# Altium schematic sheet pca20035_sheet3_nrf52_mcu.SchDoc: Thingy:91 nRF52840 MCU
size A3; Organization: Nordic Semiconductor; DocumentNumber: 3; SheetNumber: 3; SheetTotal: 6; CompanyName: Nordic Semiconductor; DocumentSize: A3
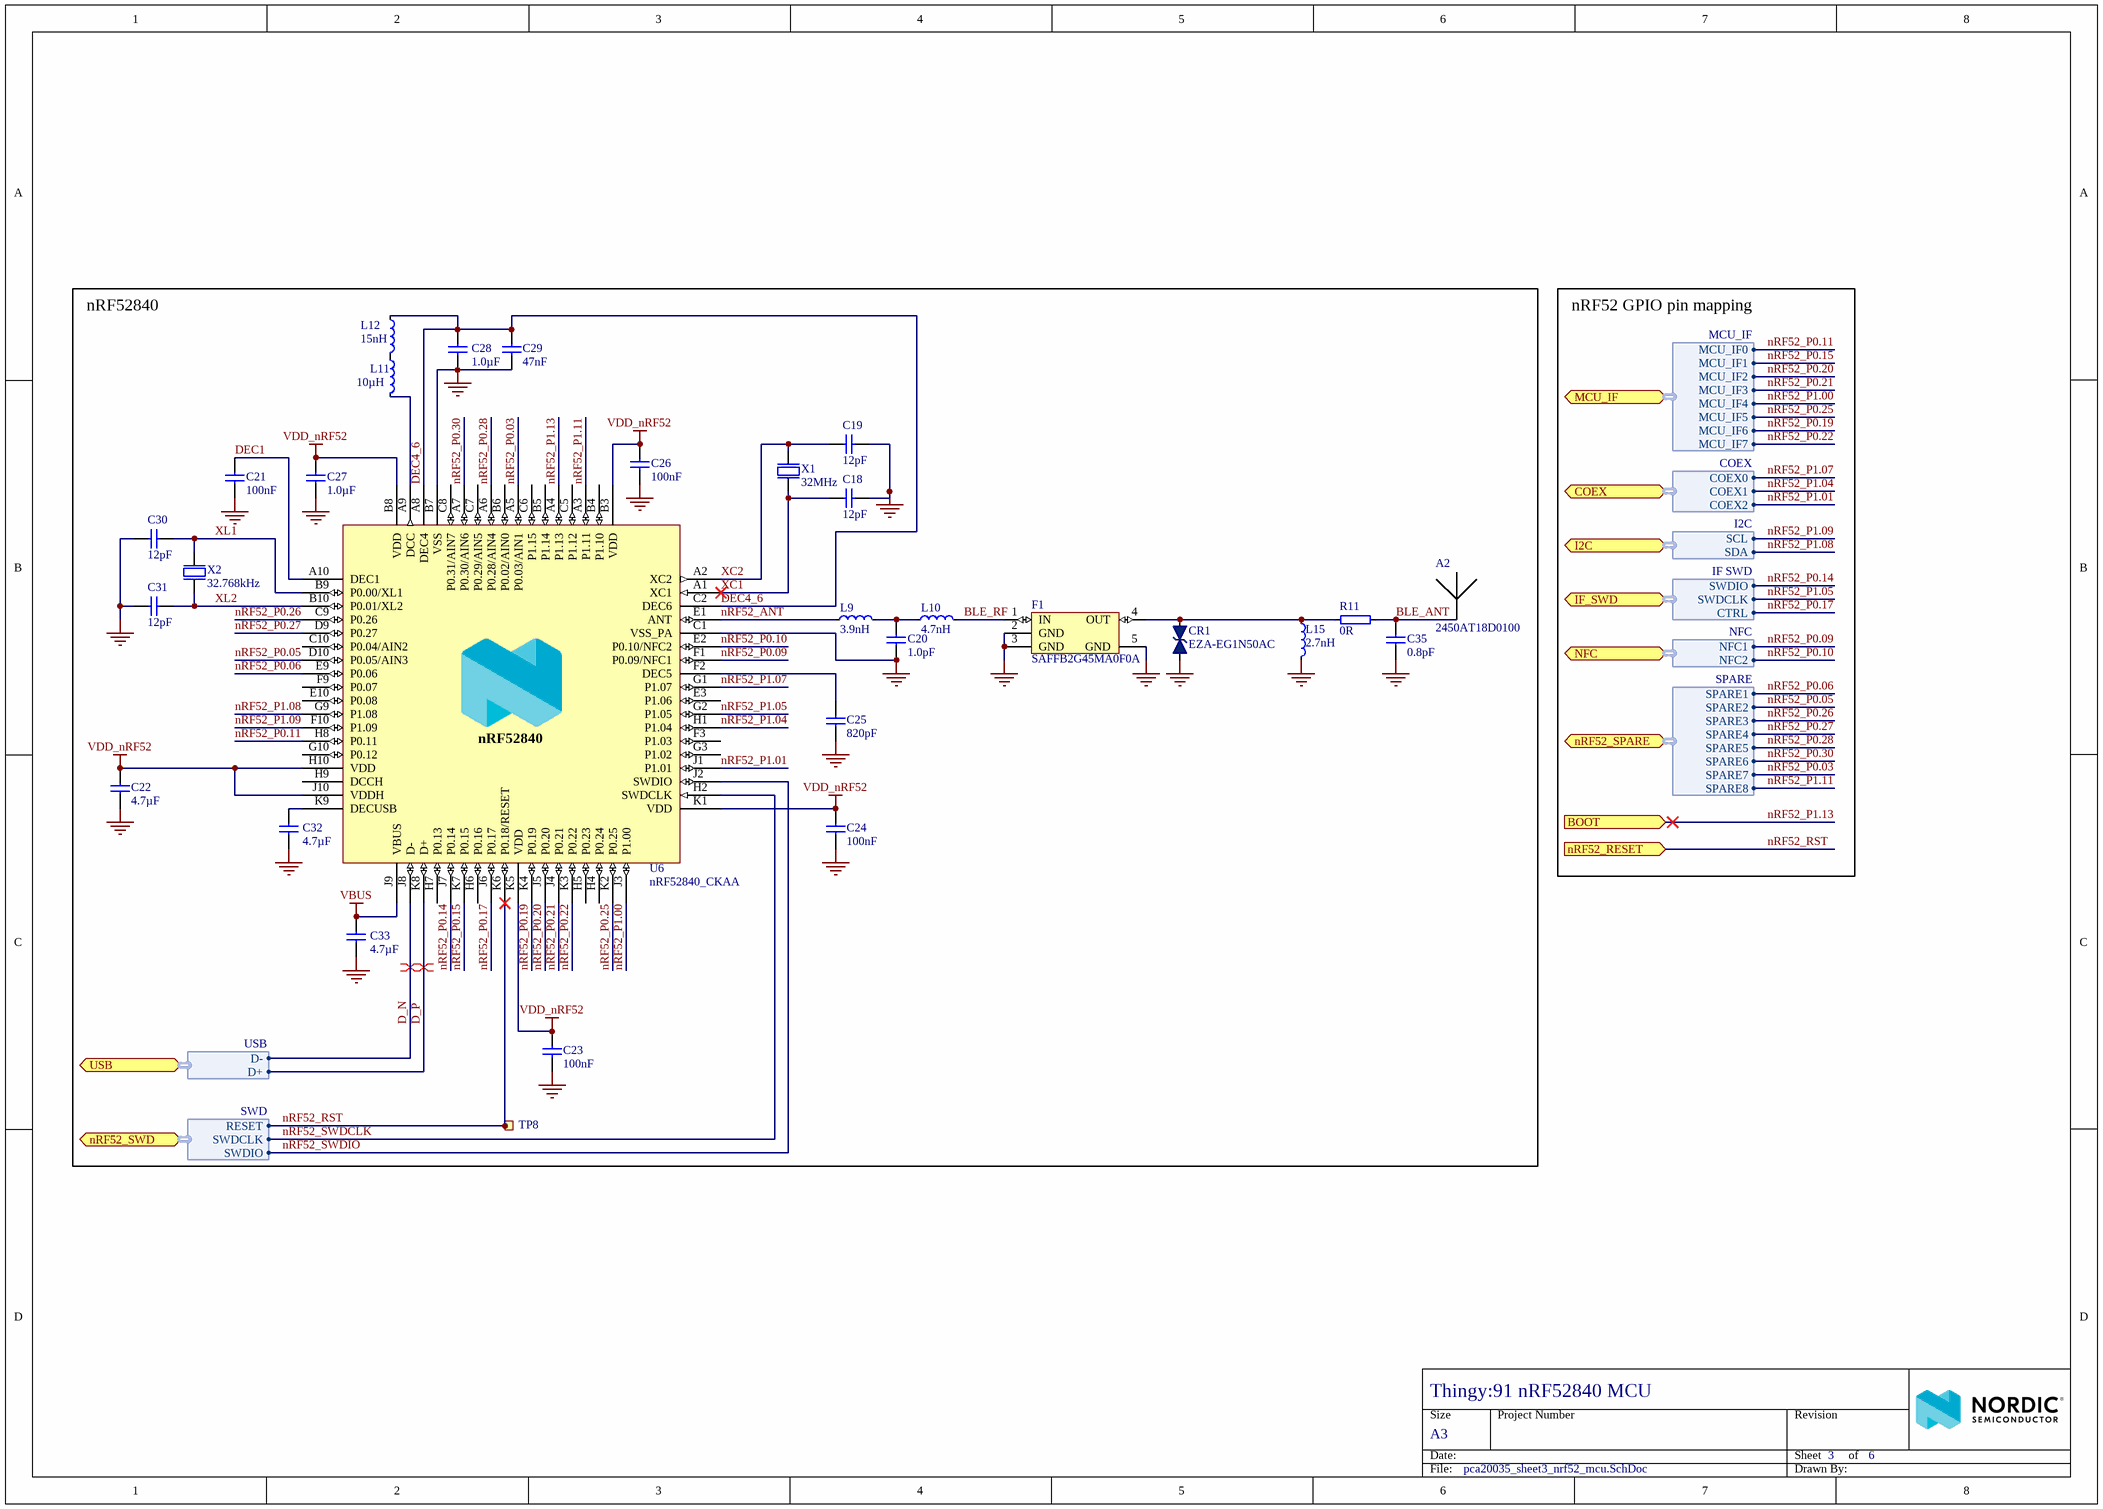
[diagram p0: pca20035_sheet3_nrf52_mcu.SchDoc]

## Parts
A2  2450AT18D0100  [2450AT18D0100_STD-R]
C18  12pF  [CAPC0603X03L_C]
C19  12pF  [CAPC0603X03L_C]
C20  1.0pF  [CAPC0603X03L_C]
C21  100nF  [CAPC0603X03L_C]
C22  4.7µF  [CAPC1608X06L]
C23  100nF  [CAPC0603X03L_C]
C24  100nF  [CAPC0603X03L_C]
C25  820pF  [CAPC0603X03L_C]
C26  100nF  [CAPC0603X03L_C]
C27  1.0µF  [CAPC1608X06L]
C28  1.0µF  [CAPC1608X06L]
C29  47nF  [CAPC0603X03L_C]
C30  12pF  [CAPC0603X03L_C]
C31  12pF  [CAPC0603X03L_C]
C32  4.7µF  [CAPC1608X06L]
C33  4.7µF  [CAPC1608X06L]
C35  0.8pF  [CAPC0603X03L_C]
CR1  EZA-EG1N50AC  [RESC0603X03L_C]
F1  SAFFB2G45MA0F0A  [SAFFB2G45MA0F0A]
L9  3.9nH  [INDC0603X03L_C]
L10  4.7nH  [INDC0603X03L_C]
L11  10µH  [INDC1608X06L]
L12  15nH  [INDC1005X04L]
L15  2.7nH  [INDC0603X03L_C]
R11  0R  [RESC0603X03L_C]
TP8  Ø1.0mm,SMD  [TP_SMD_Ø1.0mm]  (value not drawn)  (no BOM)
U6  nRF52840_CKAA  [BGA94C35P10X10_352X356X50]
X1  32MHz  [BT-XTAL_2016]
X2  32.768kHz  [XTAL_1610]

## Blocks framed on the sheet
nRF52840: A2 C18-C33 C35 CR1 F1 L9-L12 L15 R11 TP8 U6 X1 X2

## Ports
BOOT (in), COEX (bidir, harness COEX), I2C (bidir, harness I2C), IF_SWD (bidir, harness IF SWD), MCU_IF (bidir, harness MCU_IF), NFC (bidir, harness NFC), nRF52_RESET (in), nRF52_SPARE (bidir, harness SPARE), nRF52_SWD (bidir, harness SWD), USB (bidir, harness USB)

## Harnesses
SWD: SWDIO, SWDCLK, RESET
MCU_IF: MCU_IF0, MCU_IF1, MCU_IF2, MCU_IF3, MCU_IF4, MCU_IF5, MCU_IF6, MCU_IF7
I2C: SDA, SCL
COEX: COEX2, COEX1, COEX0
NFC: NFC2, NFC1
SPARE: SPARE1, SPARE2, SPARE3, SPARE4, SPARE5, SPARE6, SPARE7, SPARE8
IF SWD: SWDIO, SWDCLK, CTRL
USB: D-, D+

## Nets
GND: A2.2(GND) C18.2 C19.2 C20.1 C21.2 C22.2 C23.2 C24.2 C25.2 C26.2 C27.2 C28.1 C29.2 C30.2 C31.2 C32.2 C33.2 C35.2 CR1.1 F1.2(GND) F1.3(GND) F1.5(GND) L15.2 U6.B7(VSS) U6.C1(VSS_PA) U6.C4(GND) U6.D3(GND) U6.D4(GND) U6.D5(GND) U6.D6(GND) U6.D7(GND) U6.D8(GND) U6.E4(GND) U6.E5(GND) U6.E6(GND) U6.E7(GND) U6.E8(GND) U6.F4(GND) U6.F5(GND) U6.F6(GND) U6.F7(GND) U6.F8(GND) U6.G4(GND) U6.G5(GND) U6.G6(GND) U6.G7(GND) U6.G8(GND) U6.K10(GND) X1.2(GND) X1.4(GND)
VBUS: C33.1 U6.J9(VBUS)
VDD_nRF52: C22.1 C23.1 C24.1 C26.1 C27.1 U6.B3(VDD) U6.B8(VDD) U6.H10(VDD) U6.J10(VDDH) U6.K1(VDD) U6.K5(VDD)
BLE_ANT: A2.1 C35.1 R11.2
BLE_RF: F1.1(IN) L10.2
D_N: U6.J8(D-) ; port USB.D-
D_P: U6.K8(D+) ; port USB.D+
DEC1: C21.1 U6.A10(DEC1)
DEC4_6: C28.2 C29.1 L12.1 U6.A8(DEC4) U6.C2(DEC6)
nRF52_ANT: L9.1 U6.E1(ANT)
nRF52_P0.03: U6.A5(P0.03/AIN1) ; port nRF52_SPARE.SPARE7
nRF52_P0.05: U6.D10(P0.05/AIN3) ; port nRF52_SPARE.SPARE2
nRF52_P0.06: U6.E9(P0.06) ; port nRF52_SPARE.SPARE1
nRF52_P0.09: U6.F1(P0.09/NFC1) ; port NFC.NFC1
nRF52_P0.10: U6.E2(P0.10/NFC2) ; port NFC.NFC2
nRF52_P0.11: U6.H8(P0.11) ; port MCU_IF.MCU_IF0
nRF52_P0.14: U6.J7(P0.14) ; port IF_SWD.SWDIO
nRF52_P0.15: U6.K7(P0.15) ; port MCU_IF.MCU_IF1
nRF52_P0.17: U6.J6(P0.17) ; port IF_SWD.CTRL
nRF52_P0.19: U6.K4(P0.19) ; port MCU_IF.MCU_IF6
nRF52_P0.20: U6.J5(P0.20) ; port MCU_IF.MCU_IF2
nRF52_P0.21: U6.J4(P0.21) ; port MCU_IF.MCU_IF3
nRF52_P0.22: U6.K3(P0.22) ; port MCU_IF.MCU_IF7
nRF52_P0.25: U6.K2(P0.25) ; port MCU_IF.MCU_IF5
nRF52_P0.26: U6.C9(P0.26) ; port nRF52_SPARE.SPARE3
nRF52_P0.27: U6.D9(P0.27) ; port nRF52_SPARE.SPARE4
nRF52_P0.28: U6.A6(P0.28/AIN4) ; port nRF52_SPARE.SPARE5
nRF52_P0.30: U6.A7(P0.30/AIN6) ; port nRF52_SPARE.SPARE6
nRF52_P1.00: U6.J3(P1.00) ; port MCU_IF.MCU_IF4
nRF52_P1.01: U6.J1(P1.01) ; port COEX.COEX2
nRF52_P1.04: U6.H1(P1.04) ; port COEX.COEX1
nRF52_P1.05: U6.G2(P1.05) ; port IF_SWD.SWDCLK
nRF52_P1.07: U6.G1(P1.07) ; port COEX.COEX0
nRF52_P1.08: U6.G9(P1.08) ; port I2C.SDA
nRF52_P1.09: U6.F10(P1.09) ; port I2C.SCL
nRF52_P1.11: U6.A3(P1.11) ; port nRF52_SPARE.SPARE8
nRF52_P1.13: U6.A4(P1.13) ; port BOOT
nRF52_RST: TP8.1 U6.K6(P0.18/RESET) ; port nRF52_RESET, port nRF52_SWD.RESET
nRF52_SWDCLK: U6.H2(SWDCLK) ; port nRF52_SWD.SWDCLK
nRF52_SWDIO: U6.J2(SWDIO) ; port nRF52_SWD.SWDIO
XC1: C18.1 U6.A1(XC1) X1.1(inp)
XC2: C19.1 U6.A2(XC2) X1.3(out)
XL1: C30.1 U6.B9(P0.00/XL1) X2.1(inp)
XL2: C31.1 U6.B10(P0.01/XL2) X2.2(out)
NetC20_2: C20.2 L9.2 L10.1
NetC25_1: C25.1 U6.F2(DEC5)
NetC32_1: C32.1 U6.K9(DECUSB)
NetCR1_2: CR1.2 F1.4(OUT) L15.1 R11.1
NetL11_1: L11.1 L12.2
NetL11_2: L11.2 U6.A9(DCC)

Not connected (* = marked no-connect by the designer): U6 B4(P1.10) B5(P1.14) B6(P0.02/AIN0) C5(P1.12) C6(P1.15) C7(P0.29/AIN5) C8(P0.31/AIN7) C10(P0.04/AIN2) E3(P1.06) E10(P0.08) F3(P1.03) F9(P0.07) G3(P1.02) G10(P0.12) H4(P0.24) H5(P0.23) H6(P0.16) H7(P0.13) H9(DCCH)

## Layout directives
differential pair: D_N, D_P

## Notes on the sheet
- nRF52 GPIO pin mapping
- Size
- Date:
- A3
- Project Number
- Sheet         of
- Revision
- File:
- Drawn By:
- (in symbol nRF52840-CKAAD0) nRF52840

## Library data of the parts
A2 = Johanson 2450AT18D0100_STD-R: 2.45 GHz chip antenna; Manufacturer: Johanson Technology; Part number IPS: 00000001415; Note: N.A.; Artikkelnr Noca: 53059035; Pad Count: 4; Part Number: Johanson 2450AT18D0100_STD-R; Manufacturer Part Number: 2450AT18D0100; Footprint Doc: 2450AT18D0100; LatestRevisionDate: 2016-06-02; Published: 2016-01-12; Value: 2450AT18D0100; ComponentLink1URL: N.A.; ComponentLink1Description: Datasheet; ComponentLink2URL: N.A.; ComponentLink2Description: Supplier link; HelpURL: http://www.johansontechnology.com/datasheets/antennas/2450AT18D0100.pdf; Supplier 1: Digi-Key; Supplier Part Number 1: 2450AT18D0100E; Supplier 2: Mouser; Supplier Part Number 2: 609-2450AT18D0100E; Component Class: Antennas; PartId: 100700005
C18 C19 C30 C31 = C0201-12p: Capacitor, NP0, ±2%; Manufacturer: N.A.; Part number IPS: 00000007848; Note: 25V; Pad Count: 2; Part Number: C0201-12p; LatestRevisionDate: 2017-11-09; Published: 2014-11-13; Value: 12pF; Footprint Doc: 0201; Manufacturer Part Number: N.A.; ComponentLink1URL: N.A.; ComponentLink1Description: Datasheet; ComponentLink2URL: N.A.; ComponentLink2Description: Supplier link; HelpURL: N.A.; Supplier 1: N.A.; Supplier Part Number 1: N.A.; Supplier 2: N.A.; Supplier Part Number 2: N.A.; Artikkelnr Noca: N.A.; Component Class: Capacitors; PartId: 100200033
C20 = C0201-1.0p: Capacitor, NP0, ±0.05pF, 50V; Manufacturer: N.A.; Part number IPS: 00000001247; Pad Count: 2; Part Number: C0201-1.0p; Manufacturer Part Number: N.A.; LatestRevisionDate: 2018-10-22; Published: 2014-11-13; Value: 1.0pF; Footprint Doc: 0201; ComponentLink1URL: N.A.; ComponentLink1Description: Datasheet; ComponentLink2URL: N.A.; ComponentLink2Description: Supplier link; HelpURL: N.A.; Note: 50V; Supplier 1: N.A.; Supplier Part Number 1: N.A.; Supplier 2: N.A.; Supplier Part Number 2: N.A.; Artikkelnr Noca: N.A.; Component Class: Capacitors; PartId: 100200014
C21 C23 C24 C26 = C0201-100n: Capacitor, X5R, ±10%; Manufacturer: N.A.; Part number IPS: 00000001248, 00000002505; Note: 16V; Pad Count: 2; Part Number: C0201-100n; LatestRevisionDate: 2017-11-09; Published: 2014-11-13; Value: 100nF; Footprint Doc: 0201; Manufacturer Part Number: N.A.; ComponentLink1URL: N.A.; ComponentLink1Description: Datasheet; ComponentLink2URL: N.A.; ComponentLink2Description: Supplier link; HelpURL: N.A.; Supplier 1: N.A.; Supplier Part Number 1: N.A.; Supplier 2: N.A.; Supplier Part Number 2: N.A.; Artikkelnr Noca: N.A.; Component Class: Capacitors; PartId: 100200078
C22 C32 = C0603-4µ7-6.3V-X7R: Capacitor, X7R, ±10%, 6.3V; Manufacturer: Samsung Electro-Mechanics America; Manufacturer Part Number: CL10B475KQ8NQNC; Part number IPS: 00000002541; Artikkelnr Noca: 20039473; Pad Count: 2; Part Number: C0603-4µ7-6.3V-X7R; LatestRevisionDate: 2015-06-10; Published: 2015-06-10; Value: 4.7µF; Note: 6.3V; Footprint Doc: 0603; ComponentLink1URL: N.A.; ComponentLink1Description: Datasheet; ComponentLink2URL: N.A.; ComponentLink2Description: Supplier link; HelpURL: http://media.digikey.com/pdf/Data%20Sheets/Samsung%20PDFs/CL10B475KQ8NQNC_Spec.pdf; Supplier 1: Digi-Key; Supplier Part Number 1: 1276-2087-1-ND; Supplier 2: N.A.; Supplier Part Number 2: N.A.; Component Class: Capacitors; PartId: 100200350
C25 = C0201-820p: Capacitor, X7R, ±10%; Manufacturer: N.A.; Part number IPS: 00000001249; Note: 25V; Pad Count: 2; Part Number: C0201-820p; LatestRevisionDate: 2017-11-09; Published: 2014-11-13; Value: 820pF; Footprint Doc: 0201; Manufacturer Part Number: N.A.; ComponentLink1URL: N.A.; ComponentLink1Description: Datasheet; ComponentLink2URL: N.A.; ComponentLink2Description: Supplier link; HelpURL: N.A.; Supplier 1: N.A.; Supplier Part Number 1: N.A.; Supplier 2: N.A.; Supplier Part Number 2: N.A.; Artikkelnr Noca: N.A.; Component Class: Capacitors; PartId: 100200055
C27 C28 = C0603-1µ0: Capacitor, X7R, ±10%; Manufacturer: N.A.; Part number IPS: 00000000616; Note: 16V; Artikkelnr Noca: 20039282; Pad Count: 2; Part Number: C0603-1µ0; LatestRevisionDate: 2013-06-05; Published: 2009-05-08; Value: 1.0µF; Footprint Doc: 0603; Manufacturer Part Number: N.A.; ComponentLink1URL: N.A.; ComponentLink1Description: Datasheet; ComponentLink2URL: N.A.; ComponentLink2Description: Supplier link; HelpURL: N.A.; Supplier 1: N.A.; Supplier Part Number 1: N.A.; Supplier 2: N.A.; Supplier Part Number 2: N.A.; Component Class: Capacitors; PartId: 100200271
C29 = C0201-47n: Capacitor, X5R, ±10%; Manufacturer: N.A.; Part number IPS: 00000001250; Note: 10V; Pad Count: 2; Part Number: C0201-47n; LatestRevisionDate: 2017-11-09; Published: 2014-11-13; Value: 47nF; Footprint Doc: 0201; Manufacturer Part Number: N.A.; ComponentLink1URL: N.A.; ComponentLink1Description: Datasheet; ComponentLink2URL: N.A.; ComponentLink2Description: Supplier link; HelpURL: N.A.; Supplier 1: N.A.; Supplier Part Number 1: N.A.; Supplier 2: N.A.; Supplier Part Number 2: N.A.; Artikkelnr Noca: N.A.; Component Class: Capacitors; PartId: 100200074
C33 = C0603-4µ7-10V-X7S: Capacitor, X7S, ±10%, 10V; Manufacturer: N.A.; Part number IPS: 00000001779; Artikkelnr Noca: 20030013; Pad Count: 2; Part Number: C0603-4µ7-10V-X7S; LatestRevisionDate: 2016-08-15; Published: 2016-08-15; Value: 4.7µF; Note: 10V; Footprint Doc: 0603; Manufacturer Part Number: N.A.; ComponentLink1URL: N.A.; ComponentLink1Description: Datasheet; ComponentLink2URL: N.A.; ComponentLink2Description: Supplier link; HelpURL: N.A.; Supplier 1: Digi-Key; Supplier Part Number 1: 445-14258-1-ND; Supplier 2: N.A.; Supplier Part Number 2: N.A.; Component Class: Capacitors; PartId: 100200351
C35 = C0201-0.8p: Capacitor, NP0, ±0.05pF, 50V; Manufacturer: Murata; Manufacturer Part Number: GJM0335C1HR80WB01; Part number IPS: 80000001975; Artikkelnr Noca: N.A.; Pad Count: 2; Part Number: C0201-0.8p; LatestRevisionDate: 2018-10-22; Published: 2014-11-13; Value: 0.8pF; Note: 50V; Footprint Doc: 0201; ComponentLink1URL: N.A.; ComponentLink1Description: Datasheet; ComponentLink2URL: N.A.; ComponentLink2Description: Supplier link; HelpURL: N.A.; Supplier 1: N.A.; Supplier Part Number 1: N.A.; Supplier 2: N.A.; Supplier Part Number 2: N.A.; Component Class: Capacitors; PartId: 100200012
CR1 = EZA-EG1N50AC: ESD Suppressor, 30V, 0.04pF; Manufacturer: Panasonic; Part number IPS: 00000004437; Note: N.A.; Pad Count: 2; Part Number: EZA-EG1N50AC; Manufacturer Part Number: EZA-EG1N50AC; ComponentLink1URL: https://industrial.panasonic.com/cdbs/www-data/pdf/AWD0000/AWD0000C13.pdf; ComponentLink1Description: Datasheet; ComponentLink2URL: N.A.; ComponentLink2Description: Supplier link; HelpURL: N.A.; Footprint Doc: 0201; LatestRevisionDate: 2020-04-28; Published: 2020-02-06; Value: EZA-EG1N50AC; Artikkelnr Noca: N.A.; Supplier 1: Digi-Key; Supplier Part Number 1: P122037CT-ND; Supplier 2: N.A.; Supplier Part Number 2: N.A.; Component Class: Semiconductors; PartId: 101300173
F1 = SAFFB2G45MA0F0A: 2.4 GHz BPF; Manufacturer: Murata; Part number IPS: 00000001784, 80000001660; Artikkelnr Noca: N.A.; Pad Count: 5; Part Number: SAFFB2G45MA0F0A; Manufacturer Part Number: SAFFB2G45MA0F0A; ComponentLink1URL: N.A.; ComponentLink1Description: Datasheet; ComponentLink2URL: N.A.; ComponentLink2Description: Supplier link; HelpURL: N.A.; Footprint Doc: 1109; LatestRevisionDate: 2018-05-15; Published: 2018-05-15; Value: SAFFB2G45MA0F0A; Supplier 1: N.A.; Supplier Part Number 1: N.A.; Supplier 2: N.A.; Supplier Part Number 2: N.A.; Component Class: Filters; PartId: 100800023; Note: N.A.
L9 = L0201-3n9: Inductor, 400mA, ±0.1nH; Manufacturer: Murata; Manufacturer Part Number: LQP03TN3N9B02D; Part number IPS: 00000001253; Note: N.A.; Pad Count: 2; Part Number: L0201-3n9; LatestRevisionDate: 2017-11-09; Published: 2013-04-10; Value: 3.9nH; Footprint Doc: 0201; ComponentLink1URL: N.A.; ComponentLink1Description: Datasheet; ComponentLink2URL: N.A.; ComponentLink2Description: Supplier link; HelpURL: N.A.; Supplier 1: N.A.; Supplier Part Number 1: N.A.; Supplier 2: N.A.; Supplier Part Number 2: N.A.; Artikkelnr Noca: N.A.; Component Class: Inductors; PartId: 100300022
L10 = L0201-4n7: Inductor, 350mA, ±3%; Manufacturer: Murata; Manufacturer Part Number: LQP03TN4N7H02D; Part number IPS: 00000001792; Note: N.A.; Pad Count: 2; Part Number: L0201-4n7; LatestRevisionDate: 2013-04-10; Published: 2013-04-10; Value: 4.7nH; Footprint Doc: 0201; ComponentLink1URL: N.A.; ComponentLink1Description: Datasheet; ComponentLink2URL: N.A.; ComponentLink2Description: Supplier link; HelpURL: N.A.; Supplier 1: N.A.; Supplier Part Number 1: N.A.; Supplier 2: N.A.; Supplier Part Number 2: N.A.; Artikkelnr Noca: N.A.; Component Class: Inductors; PartId: 100300024
L11 = L0603-10µ: Inductor, 80mA, ±10%; Manufacturer: Taiyo Yuden; Manufacturer Part Number: LBMF1608T100K; Part number IPS: 00000007794; Note: LBMF1608T100K 10µH 80mA 0603; Artikkelnr Noca: 33029314; Pad Count: 2; Part Number: L0603-10µ; LatestRevisionDate: 2012-09-19; Published: 2010-02-24; Value: 10µH; Footprint Doc: 0603; ComponentLink1URL: N.A.; ComponentLink1Description: Datasheet; ComponentLink2URL: N.A.; ComponentLink2Description: Supplier link; HelpURL: http://www.yuden.co.jp/ut/product/pdf/elb2_e.pdf; Supplier 1: Digi-Key; Supplier Part Number 1: 587-1714-1-ND; Supplier 2: Farnell; Supplier Part Number 2: 178-6105; Component Class: Inductors; PartId: 100300078
L12 = L0402-15n: Inductor, 320mA, ±5%; Manufacturer: Taiyo Yuden; Manufacturer Part Number: HK100515NJ-T; Part number IPS: 00000001262; Note: High frequency chip inductor ±10%; Artikkelnr Noca: 33029323; Pad Count: 2; Part Number: L0402-15n; LatestRevisionDate: 2012-09-19; Published: 2010-07-12; Value: 15nH; Footprint Doc: 0402; ComponentLink1URL: N.A.; ComponentLink1Description: Datasheet; ComponentLink2Description: Supplier link; HelpURL: http://www.yuden.co.jp/productdata/catalog/en/mlci04_e.pdf; ComponentLink2URL: N.A.; Supplier 1: Digi-Key; Supplier Part Number 1: 587-1521-1-ND; Supplier 2: Farnell; Supplier Part Number 2: 658-1328; Component Class: Inductors; PartId: 100300056
L15 = L0201-2n7-HQ-Murata: Inductor, 600mA, ±0.1ｎH, 120mOhm; Manufacturer: Murata; Manufacturer Part Number: LQP03HQ2N7B02; Part number IPS: 00000001753; Note: -55°C ~ 125°C; Artikkelnr Noca: N.A.; Pad Count: 2; Part Number: L0201-2n7-HQ-Murata; LatestRevisionDate: 2018-10-23; Published: 2018-10-23; Value: 2.7nH; Footprint Doc: 0201; ComponentLink1URL: https://search.murata.co.jp/Ceramy/image/img/P02/JELF243C-0021.pdf; ComponentLink1Description: Datasheet; ComponentLink2URL: N.A.; ComponentLink2Description: Supplier link; HelpURL: https://psearch.en.murata.com/inductor/product/LQP03HQ2N7B02%23.html; Supplier 1: Digi-Key; Supplier Part Number 1: 490-13909-1-ND; Supplier 2: N.A.; Supplier Part Number 2: N.A.; Component Class: Inductors; PartId: 100300214
R11 = R0201-0R: Resistor, ±5%, 0.05W; Manufacturer: N.A.; Part number IPS: 00000003245; Note: Chip Res 5%; Pad Count: 2; Part Number: R0201-0R; Manufacturer Part Number: N.A.; LatestRevisionDate: 2017-11-09; Published: 2014-11-13; Value: 0R; Artikkelnr Noca: N.A.; Footprint Doc: 0201; ComponentLink1Description: Datasheet; ComponentLink2Description: Supplier link; ComponentLink1URL: N.A.; ComponentLink2URL: N.A.; HelpURL: N.A.; Supplier 1: N.A.; Supplier Part Number 1: N.A.; Supplier 2: N.A.; Supplier Part Number 2: N.A.; Component Class: Resistors; PartId: 100100001
TP8 = TP_SMD_Ø1.0MM: 1.0mm circular SMD testpad; Manufacturer: Nordic Semiconductor; Manufacturer Part Number: N.A.; Pad Count: 1; Part Number: TP_SMD_Ø1.0MM; Footprint Doc: TP_SMD_Ø1.0mm; LatestRevisionDate: 2013-06-11; Published: 2013-06-11; Value: Ø1.0mm,SMD; Note: N.A.; Artikkelnr Noca: N.A.; Part number IPS: N.A.; ComponentLink1URL: N.A.; ComponentLink1Description: Datasheet; ComponentLink2URL: N.A.; ComponentLink2Description: Supplier link; HelpURL: N.A.; Supplier 1: N.A.; Supplier Part Number 1: N.A.; Supplier 2: N.A.; Supplier Part Number 2: N.A.; Component Class: Connectors; PartId: 100500475
U6 = nRF52840-CKAAD0: Multi-protocol Bluetooth Low Energy, IEEE 802.15.4, ANT and 2.4GHz proprietary system-on-chip; Manufacturer: Nordic Semiconductor; Part number IPS: 80000001822; Note: N.A.; Pad Count: 94; Part Number: nRF52840-CKAAD0; LatestRevisionDate: 2018-12-17; Published: 2018-12-17; Value: nRF52840_CKAA; Footprint Doc: WLCSP-94; Manufacturer Part Number: nRF52840-CKAAD0; ComponentLink1URL: N.A.; ComponentLink1Description: Datasheet; ComponentLink2URL: N.A.; ComponentLink2Description: Supplier link; HelpURL: N.A.; Supplier 1: Nordic Semiconductor; Supplier Part Number 1: nRF52840-CKAAD0; Supplier 2: N.A.; Supplier Part Number 2: N.A.; Artikkelnr Noca: N.A.; Component Class: nRF_Devices; PartId: 102000136
X1 = XTAL_SMD2016_32MHz_8pF_Golledge: XTAL SMD 2016, 32MHz, Cl=8pF, Tol: ±10ppm, Stab: ±15ppm; Manufacturer Part Number: MP06003; Part number IPS: 00000001431; Note: XTAL SMD 32.000MHz; Artikkelnr Noca: 22010050; Pad Count: 4; Part Number: XTAL_SMD2016_32MHz_8pF_Golledge; LatestRevisionDate: 2016-11-02; Published: 2016-11-02; Value: 32MHz; Footprint Doc: XTAL_2016; Manufacturer: Golledge; ComponentLink1URL: N.A.; ComponentLink1Description: Datasheet; ComponentLink2URL: N.A.; ComponentLink2Description: Supplier link; HelpURL: \\hizz\pro\app9717\Datasheet\crystals\Golledge\mp06003.pdf; Supplier 1: Link Nordic; Supplier Part Number 1: N.A.; Supplier 2: N.A.; Supplier Part Number 2: N.A.; Component Class: Oscillators; PartId: 101600041
X2 = XTAL_SMD1610_32.768kHz_9pF_Seiko: XTAL SMD 1610, 32.768kHz, 9pF, ±20ppm; Manufacturer: Seiko Instruments; Manufacturer Part Number: SC16S-9.0PF20PPM; Part number IPS: 00000001802; Note: XTAL SMD 32.768kHz; Artikkelnr Noca: N.A.; Pad Count: 2; Part Number: XTAL_SMD1610_32.768kHz_9pF_Seiko; LatestRevisionDate: 2015-10-15; Published: 2015-10-15; Value: 32.768kHz; Footprint Doc: XTAL_1610; ComponentLink1URL: N.A.; ComponentLink1Description: Datasheet; ComponentLink2URL: N.A.; ComponentLink2Description: Supplier link; HelpURL: http://www.sii.co.jp/en/quartz/files/2014/07/SC-16S_Leaflet_r.pdf; Supplier 1: N.A.; Supplier Part Number 1: N.A.; Supplier 2: N.A.; Supplier Part Number 2: N.A.; Component Class: Oscillators; PartId: 101600010